# EAGLE design dummy load (EAGLE 6.6.0)
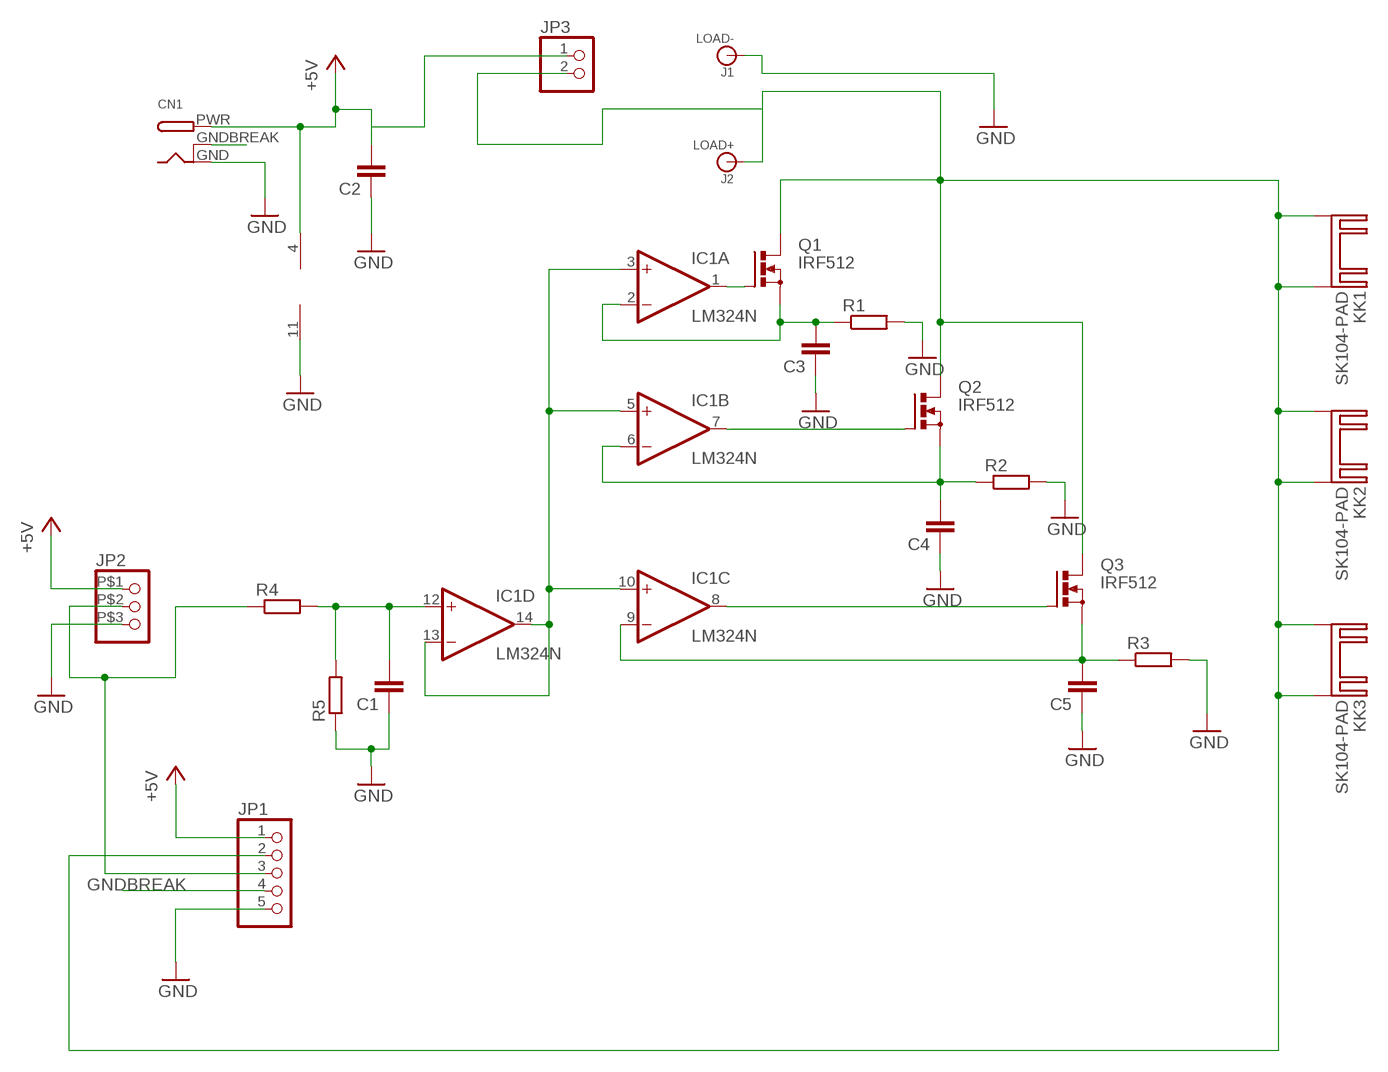
[diagram p0: schematic, sheet 1]

## Parts
C1  C-EUC0805  [C0805]
C2  C-EUC0805  [C0805]
C3  C-EUC0805  [C0805]
C4  C-EUC0805  [C0805]
C5  C-EUC0805  [C0805]
CN1  DCBARRELPTH  [DCJACK_2MM_PTH]
IC1  LM324N  [DIL14]
J1  LOAD-  BANANA_CONN  [BANANA_CONN]
J2  LOAD+  BANANA_CONN  [BANANA_CONN]
JP1  PINHD-1X5/90  [1X05/90]
JP2  PINHD-1X35.08  [1X03/5.08]
JP3  PINHD-1X2  [1X02]
KK1  SK104-PAD  [SK104-PAD]
KK2  SK104-PAD  [SK104-PAD]
KK3  SK104-PAD  [SK104-PAD]
Q1  IRF512  [TO220BV]
Q2  IRF512  [TO220BV]
Q3  IRF512  [TO220BV]
R1  R-EU_VTA52  [VTA52]
R2  R-EU_VTA52  [VTA52]
R3  R-EU_VTA52  [VTA52]
R4  R-EU_R0805  [R0805]
R5  R-EU_R0805  [R0805]

## Nets
+5V: C2.2 CN1.PWR IC1.4(P:V+) JP1.1 JP2.P$1 JP3.1
GND [load]: C1.1 C2.1 C3.1 C4.1 C5.1 CN1.GND IC1.11(P:V-) J1.P$1 JP1.5 JP2.P$3 R1.2 R2.2 R3.2 R5.1
GNDBREAK: CN1.GNDBREAK JP1.4
LOAD+ [load]: J2.P$1 JP1.2 JP3.2 KK1.K1(K) KK1.K2(K) KK2.K1(K) KK2.K2(K) KK3.K1(K) KK3.K2(K) Q1.D Q2.D Q3.D
N$1: IC1.1(A:OUT) Q1.G
N$2: IC1.7(B:OUT) Q2.G
N$3: IC1.8(C:OUT) Q3.G
N$4 [load]: C3.2 IC1.2(A:-IN) Q1.S R1.1
N$5 [load]: C4.2 IC1.6(B:-IN) Q2.S R2.1
N$6 [load]: C5.2 IC1.9(C:-IN) Q3.S R3.1
N$7: JP1.3 JP2.P$2 R4.1
N$8: IC1.3(A:+IN) IC1.5(B:+IN) IC1.10(C:+IN) IC1.13(D:-IN) IC1.14(D:OUT)
N$9: C1.2 IC1.12(D:+IN) R4.2 R5.2

## Library data of the parts
C1-C5 = rcl:C-EU: CAPACITOR, European symbol
CN1 = adafruit:DCBARREL: 2.0mm DC Barrel Jack DCJACK_2MM_PTH - Through Hole Jack (4UConnector: 05537)
IC1 = linear:LM324: OP AMP
J1 J2 = SparkFun-Connectors:BANANA_CONN: Through-hole banana jack
JP1 = 1omat:PINHD-1X5: PIN HEADER
JP2 = 1omat:PINHD-1X3: PIN HEADER
JP3 = 1omat:PINHD-1X2: PIN HEADER
KK1-KK3 = heatsink:SK104-PAD: HEATSINK manufacturer Fischer/distributor Buerklin
Q1-Q3 = transistor-power:IRF512: N-CHANNEL MOS FET
R1-R3 = rcl:R-EU_: RESISTOR, European symbol
R4 R5 = resistor:R-EU_: RESISTOR, European symbol

## Net classes
1 load: width 1.422 mm

## Board
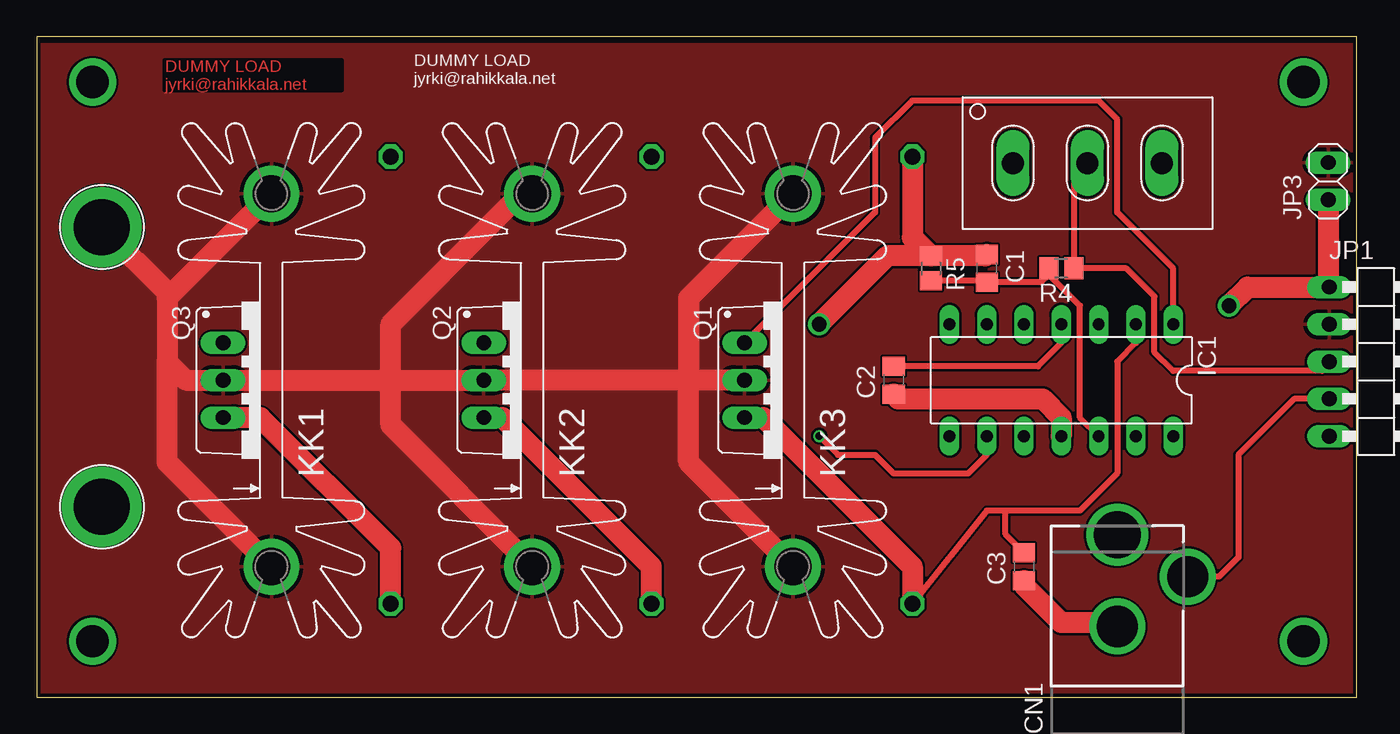
[diagram p1: board, top side]
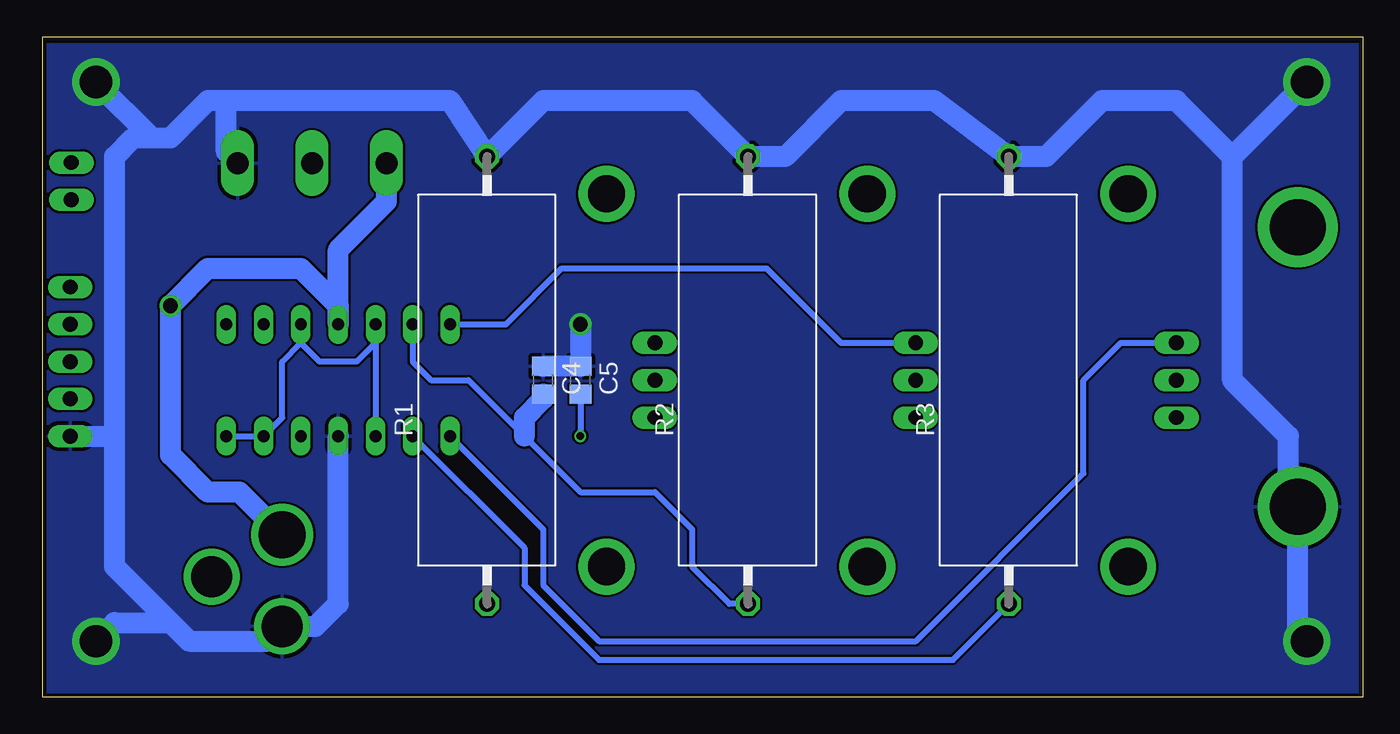
[diagram p2: board, bottom side, seen from below]

Size 90 x 45 mm. Coordinates in mm from the lower left corner, seen from the top.
Outline: 0,0 90,0 90,45 0,45 0,0
Copper layers (1*16): Top 0.035mm / dielectric 1.5mm / Bottom 0.035mm
Design rules "ITEADstudio_DRC": minimum track width 6mil, minimum drill 12mil, track to track 6mil, track to pad 6mil, pad to pad 6mil, via to via 6mil, smd to smd 0mil, copper to edge 10mil, drill to drill 10mil, minimum pad ring 10mil, minimum via ring 6mil, stop-mask expansion 2mil, vias tented up to drill 100mil, thermal gap 10mil

### Footprints (pad centres in the part's own frame; a part is rotated, then mirrored left to right if it is on the bottom)
C0805 = smd 1.3 x 1.5: 1 -0.95,0; 2 0.95,0
DCJACK_2MM_PTH = drill 2.8: GND 0,7.35; GNDBREAK 4.8,10.75 | drill 3.2: PWR 0,13.6
DIL14 = drill 0.813 long: 1 -7.62,-3.81; 2 -5.08,-3.81; 3 -2.54,-3.81; 4 0,-3.81; 5 2.54,-3.81; 6 5.08,-3.81; 7 7.62,-3.81; 8 7.62,3.81; 9 5.08,3.81; 10 2.54,3.81; 11 0,3.81; 12 -2.54,3.81; 13 -5.08,3.81; 14 -7.62,3.81
BANANA_CONN = drill 3.81 pad 5.461: P$1 0,0
1X05/90 = drill 1.016 long: 1 -5.08,-3.81; 2 -2.54,-3.81; 3 0,-3.81; 4 2.54,-3.81; 5 5.08,-3.81
1X03/5.08 = drill 1.5 long: P$1 -5.08,0; P$2 0,0; P$3 5.08,0
1X02 = drill 1.016 long: 1 -1.27,0; 2 1.27,0
SK104-PAD = drill 2.54 pad 3.81: K1 -12.7,-0.762; K2 12.7,-0.762
TO220BV = drill 1.016 long: D 0,-2.54; G -2.54,-2.54; S 2.54,-2.54
VTA52 = drill 1.1 octagon: 1 -15.24,0; 2 15.24,0
R0805 = smd 1.3 x 1.5: 1 -0.85,0; 2 0.85,0

### Placement (x,y rotation side)
C1  64.77,29.21 270 top
C2  58.42,21.59 90 top
C3  67.31,8.89 90 top
C4  55.88,21.59 270 bottom
C5  53.34,21.59 270 bottom
CN1  73.66,-2.54 0 top
IC1  69.85,21.59 180 top
J1  4.45,12.97 0 top
J2  4.45,32.02 0 top
JP1  91.92,22.86 270 top
JP2  71.63,36.39 0 top
JP3  88.04,35.15 90 top
KK1  15.24,21.59 90 top
KK2  33.02,21.59 90 top
KK3  50.8,21.59 90 top
Q1  50.8,21.59 270 top
Q2  33.02,21.59 270 top
Q3  15.24,21.59 270 top
R1  59.69,21.59 90 bottom
R2  41.91,21.59 90 bottom
R3  24.13,21.59 90 bottom
R4  69.85,29.21 180 top
R5  60.96,29.21 270 top

### Tracks (layer width: path | path; a pad name or v marks a point on that pad's centre or on a via)
+5V  (via drill 1)
  Top 0.406: IC1.4 69.85,24.13 68.26,22.54 C2.2
  Top 1.422: v81.28,26.67 82.55,27.94 JP1.1 88.04,28.02 JP3.1
  Bottom 1.422: CN1.PWR 76.57,13.97 78.74,13.97 81.28,16.51 v81.28,26.67 78.74,29.21 72.39,29.21 69.85,26.67 IC1.4 69.85,30.48 66.55,33.78 JP2.P$1
GND  (via drill 1, 2.2)
  Top 1.422: C3.1 67.31,7.62 69.85,5.08 73.66,5.08 CN1.GND | C1.1 64.67,30.06 R5.1 | R1.2 59.69,31.33 R5.1 | R5.1 58,30.06 v53.34,25.4 | C2.1 58.74,20.32 68.58,20.32 69.85,19.05 IC1.11
  Bottom 1.422: 8.89,36.83 8.89,21.59 5.08,17.78 5.08,13.61 J1.P$1 4.45,4.45 v3.81,3.81 | 8.89,36.83 12.7,40.64 17.78,40.64 21.59,36.83 R3.2 29.21,40.64 35.56,40.64 39.37,36.83 R2.2 45.72,40.64 55.88,40.64 R1.2 62.23,40.64 77.47,40.64 | IC1.11 69.85,6.35 71.39,4.81 CN1.GND 74.66,3.81 80.01,3.81 81.28,5.08 | 77.47,40.64 78.74,40.64 81.28,38.1 82.55,38.1 | v86.36,3.81 85.09,5.08 81.28,5.08 | v86.36,41.91 82.55,38.1 | v3.81,41.91 8.89,36.83 | 81.28,5.08 85.09,8.89 85.09,17.78 | 85.09,17.78 85.09,36.83 83.82,38.1 82.55,38.1 | JP2.P$3 77.47,37.15 77.47,40.64 | v53.34,25.4 C5.1 C4.1 | JP1.5 85.09,17.78
  pour Bottom: 0,0 90.17,0 90.17,44.45 0,44.45
GNDBREAK
  Top 0.406: JP1.4 85.72,20.32 81.92,16.51 81.92,9.53 80.6,8.21 CN1.GNDBREAK
LOAD+
  Top 1.422: 8.89,22.86 10.16,21.59 Q3.D 24.13,21.59 | KK1.K2 8.89,27.18 | 8.89,27.18 8.89,22.86 | KK1.K1 8.89,16 8.89,22.86 | KK2.K1 24.13,18.54 24.13,21.59 | 24.13,21.59 24.13,25.4 33.02,34.29 KK2.K2 | 24.13,21.59 Q2.D 44.45,21.59 | KK3.K1 44.45,16 44.45,21.59 | KK3.K2 44.45,27.18 44.45,21.59 | Q1.D 44.45,21.59 | J2.P$1 8.89,27.58 8.89,27.18
  pour Top: 0,0 90.17,0 90.17,44.45 0,44.45
N$1
  Top 0.406: IC1.1 77.47,29.21 73.66,33.02 73.66,39.37 72.39,40.64 59.69,40.64 57.15,38.1 57.15,33.02 Q1.G 49.53,24.13
N$2
  Bottom 0.406: IC1.7 58.42,25.4 54.61,29.21 40.64,29.21 35.56,24.13 Q2.G
N$3
  Bottom 0.406: IC1.8 55.88,11.43 55.88,7.62 52.07,3.81 30.48,3.81 19.05,15.24 19.05,21.59 16.51,24.13 Q3.G
N$4
  Top 0.406: IC1.2 74.93,24.13 73.66,22.86 73.66,15.24 71.12,12.7 66.04,12.7 | 66.04,12.7 64.77,12.7 R1.1 | C3.2 66.04,11.11 66.04,12.7
  Top 1.422: Q1.S 49.53,19.05 59.69,8.89 R1.1
N$5
  Top 1.422: Q2.S 31.75,19.05 41.91,8.89 R2.1
  Bottom 0.406: IC1.6 64.77,22.86 63.5,21.59 60.96,21.59 57.15,17.78 53.34,13.97 48.26,13.97 45.72,11.43 45.72,8.89 43.18,6.35 R2.1
  Bottom 1.422: 57.15,17.78 57.15,19.05 55.88,20.32 C4.2
N$6  (via drill 0.5)
  Top 0.406: v53.34,17.78 54.61,16.51 57.15,16.51 58.42,15.24 63.5,15.24 64.77,16.51 IC1.9
  Top 1.422: Q3.S 15.24,19.05 24.13,10.16 R3.1
  Bottom 0.406: IC1.9 57.15,10.16 57.15,7.62 52.07,2.54 27.94,2.54 R3.1 | C5.2 v53.34,17.78
N$7
  Top 0.406: JP1.3 87.63,22.23 77.47,22.23 76.2,23.5 76.2,27.3 74.3,29.21 R4.1 70.7,35.46 JP2.P$2
N$8
  Bottom 0.406: 67.31,24.13 IC1.10 | IC1.5 67.31,24.13 | 67.31,24.13 68.58,22.86 71.12,22.86 72.39,24.13 | IC1.14 IC1.13 73.66,19.05 73.66,22.86 72.39,24.13 | 72.39,24.13 IC1.3
N$9
  Top 0.406: IC1.12 71.12,19.05 71.12,26.67 69,28.79 | 69,28.79 R4.2 | 69,28.79 68.47,28.26 C1.2 64.67,28.36 R5.2

### Text on the board
Top: DUMMY LOAD / jyrki@rahikkala.net
tNames: DUMMY LOAD / jyrki@rahikkala.net
_tNames: VCC | LOAD+ | ADJ. | GNDBREAK | GND/ / LOAD-